# Altium schematic sheet cor-balance.SchDoc
size A1; SPICEModelCacheYQEDCYZF: <root> / <DocumentId>YQEDCYZF</DocumentId> / </root>
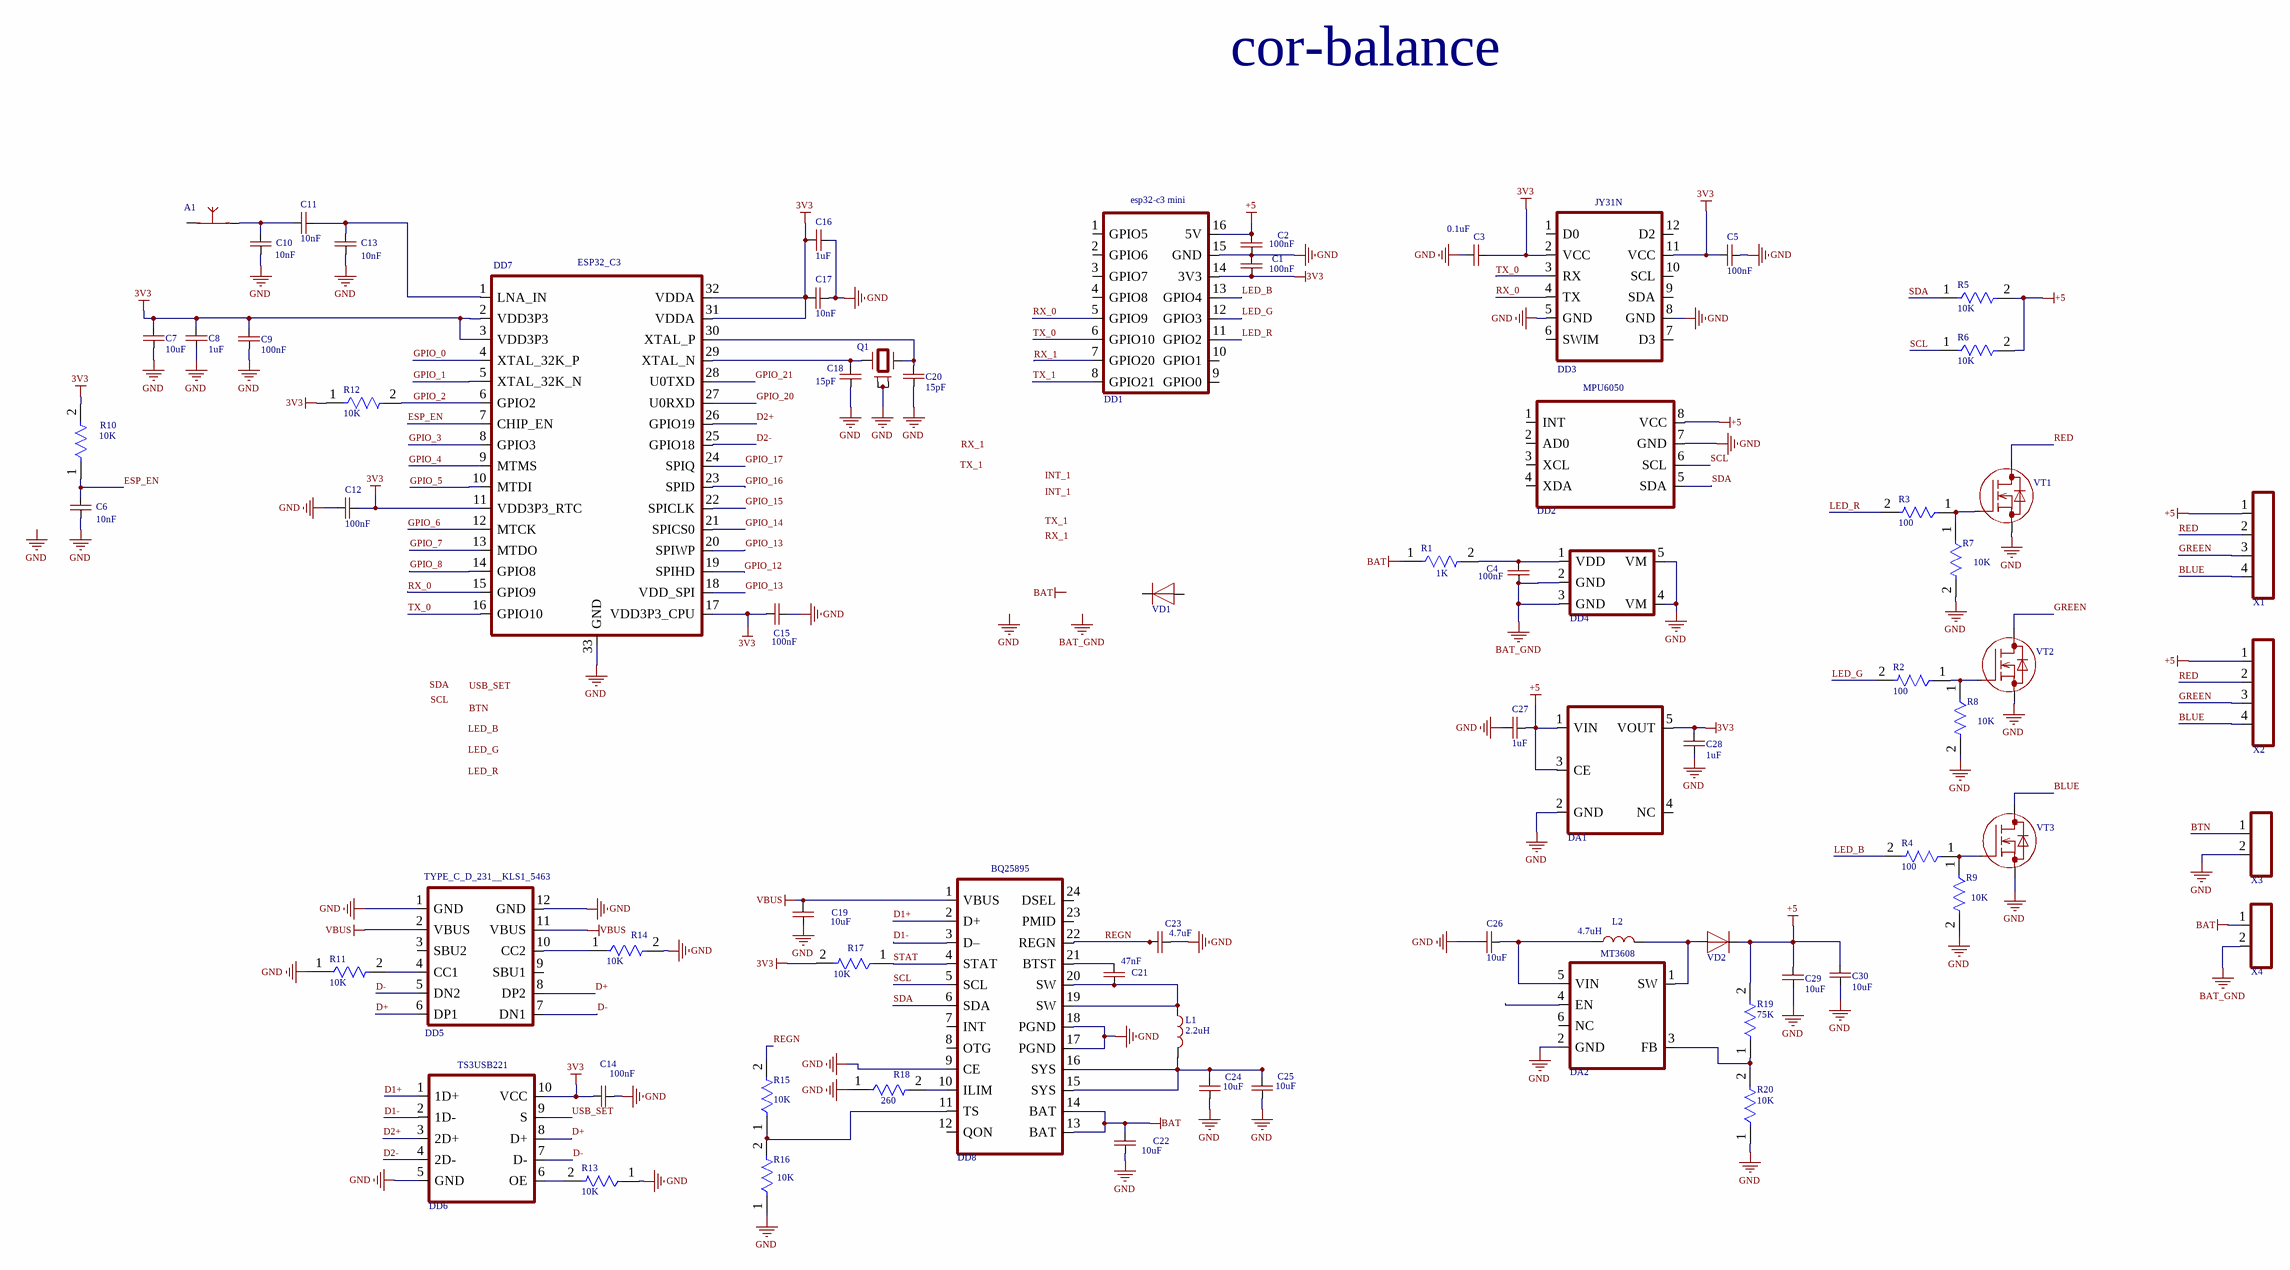
[diagram p0: cor-balance.SchDoc]

## Parts
A1  CA-C03  [CA-C03]  (value not drawn)
C1  100nF  [CAP-0805]
C2  100nF  [CAP-0805]
C3  0.1uF  [CAP-0805]
C4  100nF  [CAP-0805]
C5  100nF  [CAP-0805]
C6  10nF  [CAP-0805]
C7  10uF  [CAP-0805]
C8  1uF  [CAP-0805]
C9  100nF  [CAP-0805]
C10  10nF  [CAP-0805]
C11  10nF  [CAP-0805]
C12  100nF  [CAP-0805]
C13  10nF  [CAP-0805]
C14  100nF  [CAP-0805]
C15  100nF  [CAP-0805]
C16  1uF  [CAP-0805]
C17  10nF  [CAP-0805]
C18  15pF  [CAP-0402]
C19  10uF  [CAP-0805]
C20  15pF  [CAP-0402]
C21  47nF  [CAP-0805]
C22  10uF  [CAP-0805]
C23  4.7uF  [CAP-0805]
C24  10uF  [CAP-0805]
C25  10uF  [CAP-0805]
C26  10uF  [CAP-0805]
C27  1uF  [CAP-0805]
C28  1uF  [CAP-0805]
C29  10uF  [CAP-0805]
C30  10uF  [CAP-0805]
DA1  ME6211  [SOT23-5]  (value not drawn)
DA2  MT3608  [SOT23-6]
DD1  esp32-c3 mini  [esp32-c3 mini]
DD2  MPU6050  [MPU6050]
DD3  JY31N  [JY31N]
DD4  XB7608A  [XB7608A]  (value not drawn)
DD5  TYPE_C_D_231__KLS1_5463  [TYPE-C-D-231__KLS1-5463]
DD6  TS3USB221  [TS3USB221]
DD7  ESP32_C3  [QFN-32 (5x5)]
DD8  BQ25895  [WQFN-24]
L1  2.2uH  [SND_0504]
L2  4.7uH  [SND_0504]
Q1  OSC-4-PIN  [OSC-QSMD3.2x2.5x1.0]  (value not drawn)
R1  1K  [RES-0805]
R2  100  [RES-0805]
R3  100  [RES-0805]
R4  100  [RES-0805]
R5  10K  [RES-0805]
R6  10K  [RES-0805]
R7  10K  [RES-0805]
R8  10K  [RES-0805]
R9  10K  [RES-0805]
R10  10K  [RES-0201]
R11  10K  [RES-0201]
R12  10K  [RES-0201]
R13  10K  [RES-0201]
R14  10K  [RES-0201]
R15  10K  [RES-0201]
R16  10K  [RES-0201]
R17  10K  [RES-0201]
R18  260  [RES-0201]
R19  75K  [RES-0201]
R20  10K  [RES-0201]
VD1  DIODE  [DO-214AC, SMA]  (value not drawn)
VD2  DIODE  [DO-214AC, SMA]  (value not drawn)
VT1  MOSFET-N-GSD  [SOT23-3]  (value not drawn)
VT2  MOSFET-N-GSD  [SOT23-3]  (value not drawn)
VT3  MOSFET-N-GSD  [SOT23-3]  (value not drawn)
X1  CONN-4-PIN  [CONN-PLS-4-2.54mm]  (value not drawn)
X2  CONN-4-PIN  [CONN-PLS-4-2.54mm]  (value not drawn)
X3  CONN-2-PIN  [CONN-PLS-2-2.54mm]  (value not drawn)
X4  CONN-2-PIN  [CONN-PLS-2-2.54mm]  (value not drawn)

## Nets
3V3: C1.1 C3.1 C5.2 C7.2 C8.2 C9.2 C12.1 C14.2 C15.1 C16.1 C17.2 C28.1 DA1.5(VOUT) DD1.14(3V3) DD3.2(VCC) DD3.11(VCC) DD6.10(VCC) DD7.2(VDD3P3) DD7.3(VDD3P3) DD7.11(VDD3P3_RTC) DD7.17(VDD3P3_CPU) DD7.31(VDDA) DD7.32(VDDA) R10.2 R12.1 R17.2
+5: C2.2 C27.1 C29.1 C30.1 DA1.1(VIN) DA1.3(CE) DD1.16(5V) DD2.8(VCC) R5.2 R6.2 R19.2 VD2.1(C) X1.1 X2.1
BAT: C22.2 DD8.13(BAT) DD8.14(BAT) R1.1 X4.1
BAT_GND: C4.1 DD4.2(GND) DD4.3(GND) X4.2
GND: C1.2 C2.1 C3.2 C5.1 C6.2 C7.1 C8.1 C9.1 C10.2 C12.2 C13.2 C14.1 C15.2 C16.2 C17.1 C18.1 C19.1 C20.1 C22.1 C23.1 C24.1 C25.1 C26.2 C27.2 C28.2 C29.2 C30.2 DA1.2(GND) DA2.2(GND) DD1.15(GND) DD2.7(GND) DD3.5(GND) DD3.8(GND) DD4.4(VM) DD4.5(VM) DD5.1(GND) DD5.12(GND) DD6.5(GND) DD7.33(GND) DD8.9(CE) DD8.17(PGND) DD8.18(PGND) Q1.2 Q1.4 R7.2 R8.2 R9.2 R11.1 R13.1 R14.2 R16.1 R18.1 R20.1 VT1.2(S) VT2.2(S) VT3.2(S) X3.2
VBUS: C19.2 DD5.2(VBUS) DD5.11(VBUS) DD8.1(VBUS)
BLUE: VT3.3(D) X1.4 X2.4
BTN: X3.1
D1+: DD6.1(1D+) DD8.2(D+)
D1-: DD6.2(1D-) DD8.3(D–)
D2+: DD6.3(2D+) DD7.26(GPIO19)
D2-: DD6.4(2D-) DD7.25(GPIO18)
D+: DD5.6(DP1) DD5.8(DP2) DD6.8(D+)
D-: DD5.5(DN2) DD5.7(DN1) DD6.7(D-)
ESP_EN: C6.1 DD7.7(CHIP_EN) R10.1
GPIO_0: DD7.4(XTAL_32K_P)
GPIO_1: DD7.5(XTAL_32K_N)
GPIO_2: DD7.6(GPIO2) R12.2
GPIO_3: DD7.8(GPIO3)
GPIO_4: DD7.9(MTMS)
GPIO_5: DD7.10(MTDI)
GPIO_6: DD7.12(MTCK)
GPIO_7: DD7.13(MTDO)
GPIO_8: DD7.14(GPIO8)
GPIO_12: DD7.19(SPIHD)
GPIO_13: DD7.18(VDD_SPI) DD7.20(SPIWP)
GPIO_14: DD7.21(SPICS0)
GPIO_15: DD7.22(SPICLK)
GPIO_16: DD7.23(SPID)
GPIO_17: DD7.24(SPIQ)
GPIO_20: DD7.27(U0RXD)
GPIO_21: DD7.28(U0TXD)
GREEN: VT2.3(D) X1.3 X2.3
LED_B: DD1.13(GPIO4) R4.2
LED_G: DD1.12(GPIO3) R2.2
LED_R: DD1.11(GPIO2) R3.2
RED: VT1.3(D) X1.2 X2.2
REGN: C23.2 DD8.22(REGN) R15.2
RX_0: DD1.5(GPIO9) DD3.4(TX) DD7.15(GPIO9)
RX_1: DD1.7(GPIO20)
SCL: DD2.6(SCL) DD8.5(SCL) R6.1
SDA: DD2.5(SDA) DD8.6(SDA) R5.1
STAT: DD8.4(STAT) R17.1
TX_0: DD1.6(GPIO10) DD3.3(RX) DD7.16(GPIO10)
TX_1: DD1.8(GPIO21)
USB_SET: DD6.9(S)
NetA1_1: A1.1 C10.1 C11.1
NetC4_2: C4.2 DD4.1(VDD) R1.2
NetC11_2: C11.2 C13.1 DD7.1(LNA_IN)
NetC18_2: C18.2 DD7.29(XTAL_N) Q1.1
NetC20_2: C20.2 DD7.30(XTAL_P) Q1.3
NetC21_1: C21.1 DD8.19(SW) DD8.20(SW) L1.1
NetC21_2: C21.2 DD8.21(BTST)
NetC24_2: C24.2 C25.2 DD8.15(SYS) DD8.16(SYS) L1.2
NetC26_1: C26.1 DA2.5(VIN) L2.1
NetDA2_1: DA2.1(SW) L2.2 VD2.2(A)
NetDA2_3: DA2.3(FB) R19.1 R20.2
NetDD5_4: DD5.4(CC1) R11.2
NetDD5_10: DD5.10(CC2) R14.1
NetDD6_6: DD6.6(OE) R13.2
NetDD8_10: DD8.10(ILIM) R18.2
NetDD8_11: DD8.11(TS) R15.1 R16.2
NetR2_1: R2.1 R8.1 VT2.1(G)
NetR3_1: R3.1 R7.1 VT1.1(G)
NetR4_1: R4.1 R9.1 VT3.1(G)

Not connected (* = marked no-connect by the designer): A1 2; DA1 4(NC); DA2 4(EN) 6(NC); DD1 1(GPIO5) 2(GPIO6) 3(GPIO7) 4(GPIO8) 9(GPIO0) 10(GPIO1); DD2 1(INT) 2(AD0) 3(XCL) 4(XDA); DD3 1(D0) 6(SWIM) 7(D3) 9(SDA) 10(SCL) 12(D2); DD5 3(SBU2) 9(SBU1); DD8 7(INT) 8(OTG) 12(QON) 23(PMID) 24(DSEL); VD1 1(C) 2(A)

## Notes on the sheet
- cor-balance
- Labels drawn without touching a wire or pin: BAT, BAT_GND, BTN, GND, INT_1, LED_B, LED_G, LED_R, RX_1, SCL, SDA, TX_1, USB_SET

## Library data of the parts
C1-C30 = CAP-NON-POLAR
L1 L2 = IND-CONST
R1-R4 = RES-CONST: 10K
R5-R20 = RES-CONST